# Altium schematic sheet H750Common4.SchDoc
size A3
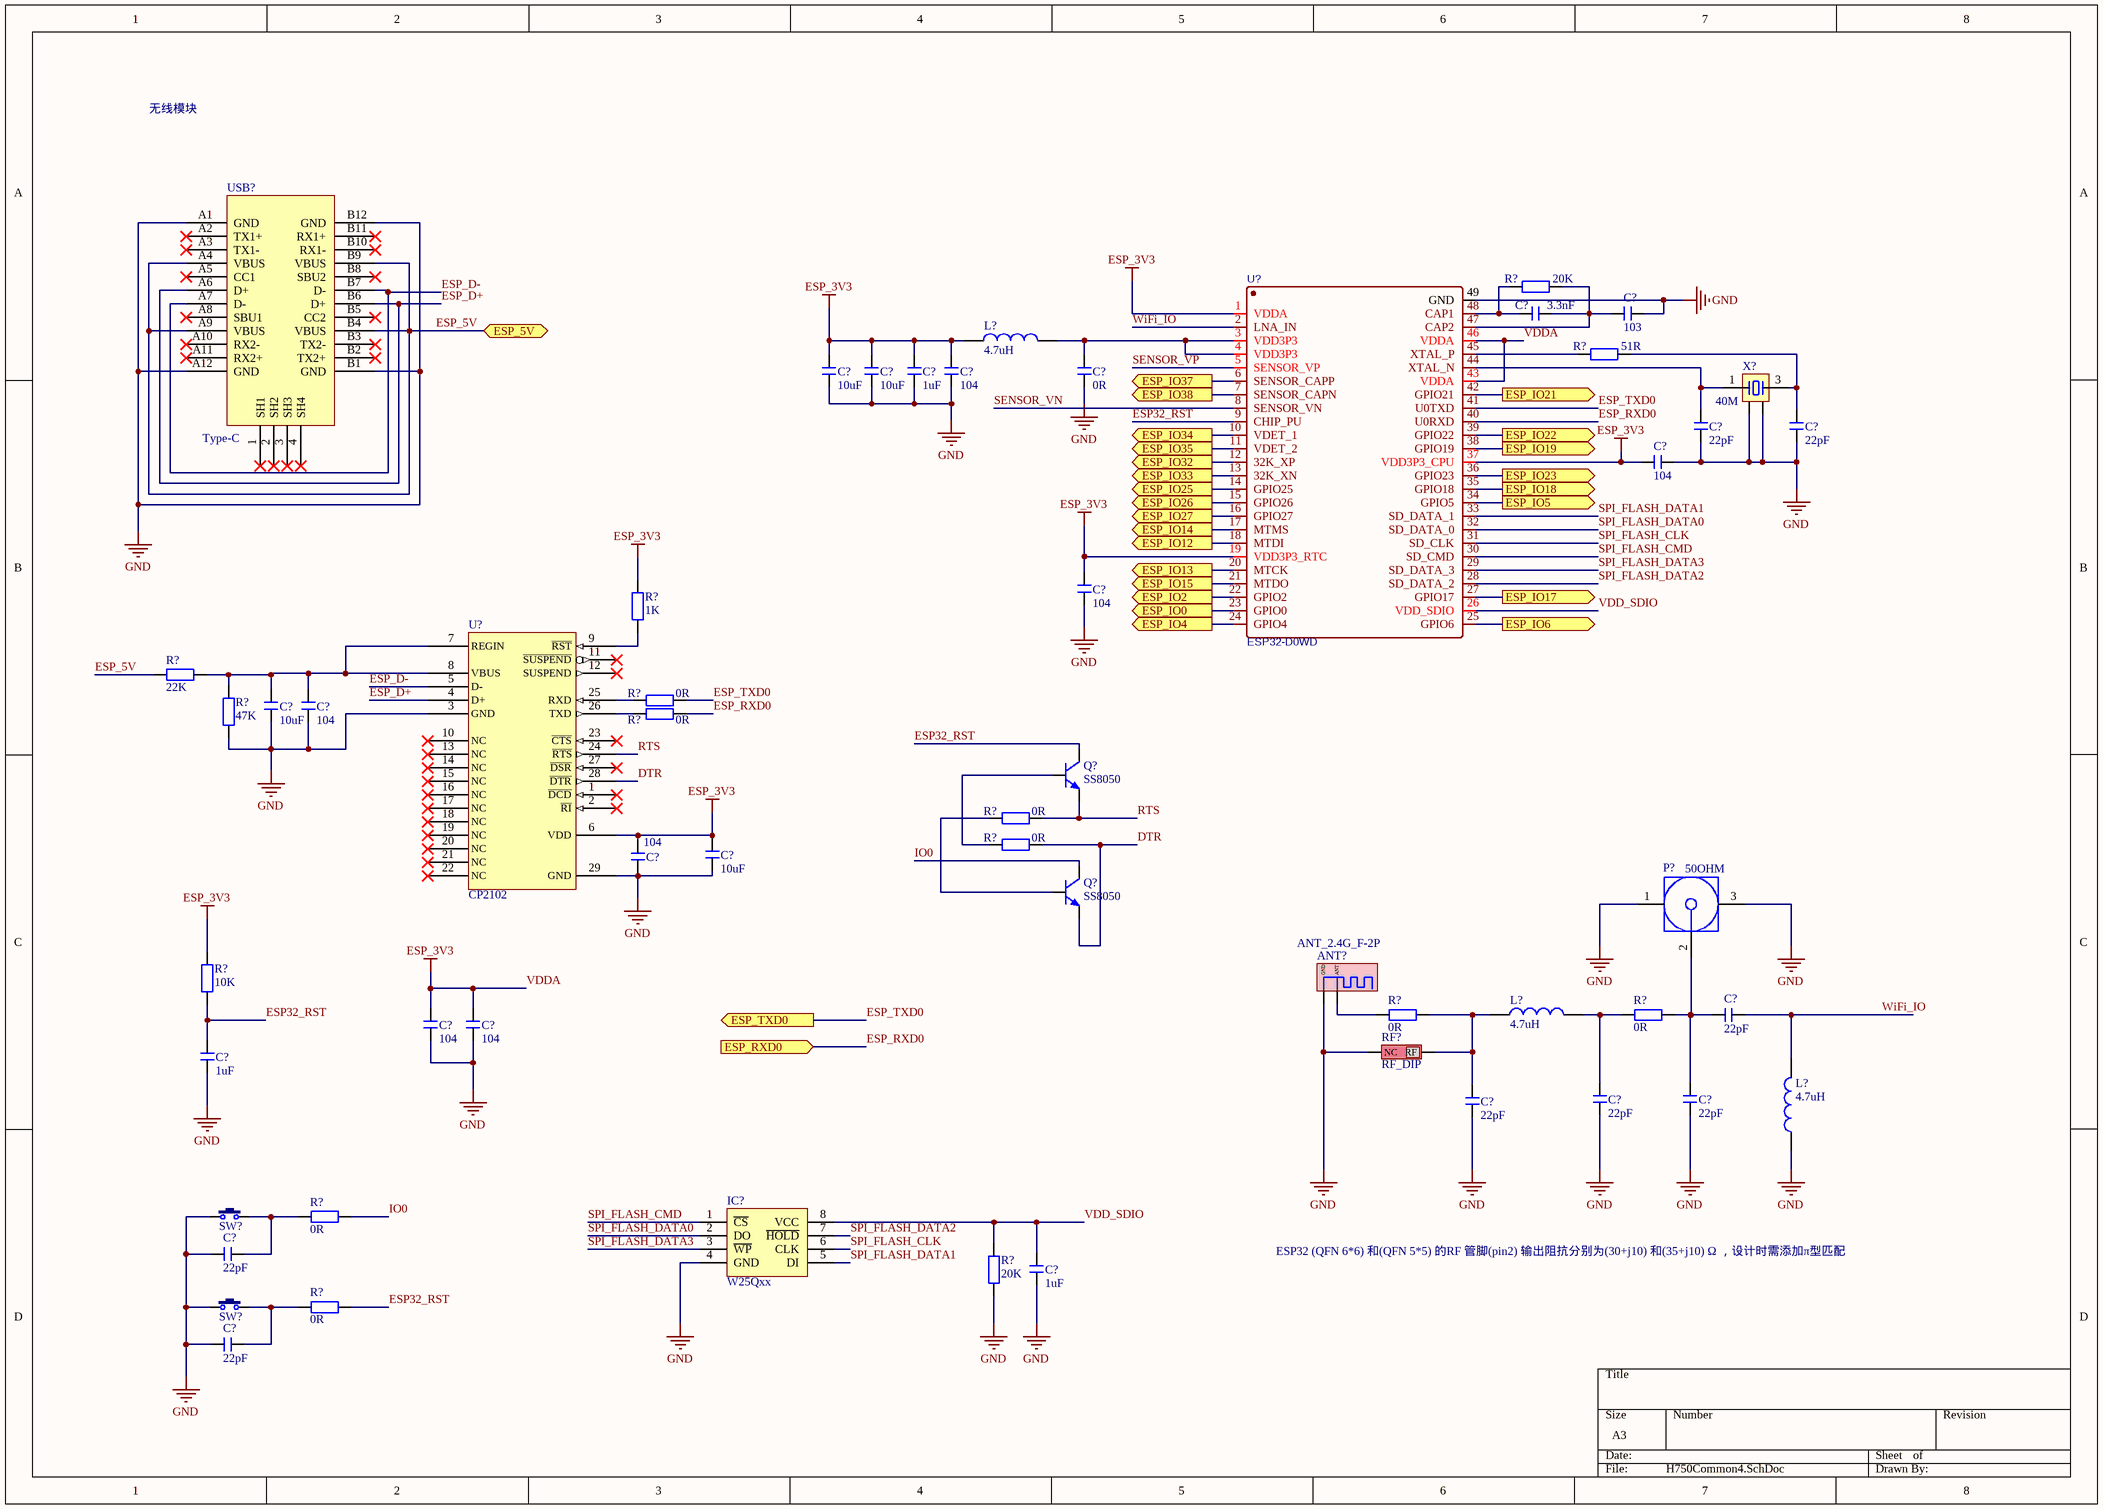
[diagram p0: H750Common4.SchDoc]

## Parts
(Parts that share a designator on the sheet are numbered #1, #2 ... from top to bottom, then left to right.)
ANT?  ANT_2.4G_F-2P  [ANT_2.4G_F-2P-1]
C?#1  3.3nF  [C 0603_L]
C?#2  103  [C 0603_L]
C?#3  10uF  [C 0603_L]
C?#4  10uF  [C 0603_L]
C?#5  1uF  [C 0603_L]
C?#6  104  [C 0603_L]
C?#7  0R  [C 0603_L]
C?#8  22pF  [C 0603_L]
C?#9  22pF  [C 0603_L]
C?#10  104  [C 0603_L]
C?#11  104  [C 0603_L]
C?#12  10uF  [C 0603_L]
C?#13  104  [C 0603_L]
C?#14  10uF  [C 0603_L]
C?#15  104  [C 0603_L]
C?#16  104  [C 0603_L]
C?#17  104  [C 0603_L]
C?#18  22pF  [C 0603_L]
C?#19  1uF  [C 0603_L]
C?#20  22pF  [C 0603_L]
C?#21  22pF  [C 0603_L]
C?#22  22pF  [C 0603_L]
C?#23  22pF  [C 0603_L]
C?#24  1uF  [C 0603_L]
C?#25  22pF  [C 0603_L]
IC?  W25Qxx  [SOP8W_N]
L?#1  4.7uH  [L 0603]
L?#2  4.7uH  [L 0603]
L?#3  4.7uH  [L 0603]
P?  50OHM  [IPEX]
Q?#1  SS8050  [SOT23-3N]
Q?#2  SS8050  [SOT23-3N]
R?#1  20K  [R 0603_L]
R?#2  51R  [R 0603_L]
R?#3  1K  [R 0603_L]
R?#4  22K  [R 0603_L]
R?#5  47K  [R 0603_L]
R?#6  0R  [R 0603_L]
R?#7  0R  [R 0603_L]
R?#8  0R  [R 0603_L]
R?#9  0R  [R 0603_L]
R?#10  10K  [R 0603_L]
R?#11  0R  [R 0603_L]
R?#12  0R  [R 0603_L]
R?#13  0R  [R 0603_L]
R?#14  20K  [R 0603_L]
R?#15  0R  [R 0603_L]
RF?  RF_DIP  [ANT_LA31H2450-A35]
SW?#1  3x6x5  [TSW SMD-3*6*2.5]  (value not drawn)
SW?#2  3x6x5  [TSW SMD-3*6*2.5]  (value not drawn)
U?#1  ESP32-D0WD  [ESP32-D0WD]
U?#2  CP2102  [CP2102-N]
USB?  Type-C  [Type-C]
X?  40M  [OSC 5032-4P]

## Ports
ESP_5V (bidir), ESP_IO0 (out), ESP_IO2 (out), ESP_IO4 (out), ESP_IO5 (out), ESP_IO6 (out), ESP_IO12 (out), ESP_IO13 (out), ESP_IO14 (out), ESP_IO15 (out), ESP_IO17 (out), ESP_IO18 (out), ESP_IO19 (out), ESP_IO21 (out), ESP_IO22 (out), ESP_IO23 (out), ESP_IO25 (out), ESP_IO26 (out), ESP_IO27 (out), ESP_IO32 (out), ESP_IO33 (out), ESP_IO34 (out), ESP_IO35 (out), ESP_IO37 (out), ESP_IO38 (out), ESP_RXD0 (in), ESP_TXD0 (out)

## Nets
GND: ANT?.2(GND) C?#2.1 C?#3.1 C?#4.1 C?#5.1 C?#6.1 C?#7.1 C?#8.1 C?#9.1 C?#10.1 C?#11.1 C?#12.1 C?#13.1 C?#14.1 C?#15.1 C?#16.2 C?#17.2 C?#19.1 C?#20.2 C?#21.2 C?#22.2 C?#23.2 C?#24.1 C?#25.2 IC?.4(GND) L?#3.1 P?.1 P?.3 R?#5.2 R?#14.2 RF?.2(NC) SW?#1.1 SW?#2.1 U?#1.49(GND) U?#2.3(GND) U?#2.29(GND) USB?.A1(GND) USB?.A12(GND) USB?.B1(GND) USB?.B12(GND) X?.2 X?.4
VDDA: C?#3.2 C?#4.2 C?#5.2 C?#6.2 C?#10.2 C?#11.2 C?#14.2 C?#15.2 C?#16.1 C?#17.1 L?#1.1 R?#3.1 R?#10.1 U?#1.1(VDDA) U?#1.19(VDD3P3_RTC) U?#1.37(VDD3P3_CPU) U?#1.43(VDDA) U?#1.46(VDDA) U?#2.6(VDD)  [also labelled ESP_3V3]
DTR: Q?#2.2(E) R?#9.2 U?#2.28(~{DTR})
ESP32_RST: C?#19.2 Q?#1.3(C) R?#10.2 R?#15.1 U?#1.9(CHIP_PU)
ESP_5V: R?#4.1 USB?.A4(VBUS) USB?.A9(VBUS) USB?.B4(VBUS) USB?.B9(VBUS) ; port ESP_5V
ESP_D+: U?#2.4(D+) USB?.A6(D+) USB?.B6(D+)
ESP_D-: U?#2.5(D-) USB?.A7(D-) USB?.B7(D-)
ESP_IO0: U?#1.23(GPIO0) ; port ESP_IO0
ESP_IO2: U?#1.22(GPIO2) ; port ESP_IO2
ESP_IO4: U?#1.24(GPIO4) ; port ESP_IO4
ESP_IO5: U?#1.34(GPIO5) ; port ESP_IO5
ESP_IO6: U?#1.25(GPIO6) ; port ESP_IO6
ESP_IO12: U?#1.18(MTDI) ; port ESP_IO12
ESP_IO13: U?#1.20(MTCK) ; port ESP_IO13
ESP_IO14: U?#1.17(MTMS) ; port ESP_IO14
ESP_IO15: U?#1.21(MTDO) ; port ESP_IO15
ESP_IO17: U?#1.27(GPIO17) ; port ESP_IO17
ESP_IO18: U?#1.35(GPIO18) ; port ESP_IO18
ESP_IO19: U?#1.38(GPIO19) ; port ESP_IO19
ESP_IO21: U?#1.42(GPIO21) ; port ESP_IO21
ESP_IO22: U?#1.39(GPIO22) ; port ESP_IO22
ESP_IO23: U?#1.36(GPIO23) ; port ESP_IO23
ESP_IO25: U?#1.14(GPIO25) ; port ESP_IO25
ESP_IO26: U?#1.15(GPIO26) ; port ESP_IO26
ESP_IO27: U?#1.16(GPIO27) ; port ESP_IO27
ESP_IO32: U?#1.12(32K_XP) ; port ESP_IO32
ESP_IO33: U?#1.13(32K_XN) ; port ESP_IO33
ESP_IO34: U?#1.10(VDET_1) ; port ESP_IO34
ESP_IO35: U?#1.11(VDET_2) ; port ESP_IO35
ESP_IO37: U?#1.6(SENSOR_CAPP) ; port ESP_IO37
ESP_IO38: U?#1.7(SENSOR_CAPN) ; port ESP_IO38
ESP_RXD0: R?#7.2 U?#1.40(U0RXD) ; port ESP_RXD0
ESP_TXD0: R?#6.2 U?#1.41(U0TXD) ; port ESP_TXD0
IO0: Q?#2.3(C) R?#13.1
RTS: Q?#1.2(E) R?#8.2 U?#2.24(~{RTS})
SENSOR_VN: U?#1.8(SENSOR_VN)
SENSOR_VP: U?#1.5(SENSOR_VP)
SPI_FLASH_CLK: IC?.6(CLK) U?#1.31(SD_CLK)
SPI_FLASH_CMD: IC?.1(~{CS}) U?#1.30(SD_CMD)
SPI_FLASH_DATA0: IC?.2(DO) U?#1.32(SD_DATA_0)
SPI_FLASH_DATA1: IC?.5(DI) U?#1.33(SD_DATA_1)
SPI_FLASH_DATA2: IC?.7(~{HOLD}) U?#1.28(SD_DATA_2)
SPI_FLASH_DATA3: IC?.3(~{WP}) U?#1.29(SD_DATA_3)
VDD_SDIO: C?#24.2 IC?.8(VCC) R?#14.1 U?#1.26(VDD_SDIO)
WiFi_IO: C?#18.1 L?#3.2 U?#1.2(LNA_IN)
NetANT?_1: ANT?.1(ANT) R?#11.2
NetC?#1_1: C?#1.1 C?#2.2 R?#1.1 U?#1.47(CAP2)
NetC?#1_2: C?#1.2 R?#1.2 U?#1.48(CAP1)
NetC?#7_2: C?#7.2 L?#1.2 U?#1.3(VDD3P3) U?#1.4(VDD3P3)
NetC?#8_2: C?#8.2 U?#1.44(XTAL_N) X?.1
NetC?#9_2: C?#9.2 R?#2.1 X?.3
NetC?#12_2: C?#12.2 C?#13.2 R?#4.2 R?#5.1 U?#2.7(REGIN) U?#2.8(VBUS)
NetC?#18_2: C?#18.2 C?#22.1 P?.2 R?#12.1
NetC?#20_1: C?#20.1 L?#2.1 R?#11.1 RF?.1(RF)
NetC?#21_1: C?#21.1 L?#2.2 R?#12.2
NetC?#23_1: C?#23.1 R?#13.2 SW?#1.2
NetC?#25_1: C?#25.1 R?#15.2 SW?#2.2
NetQ?#1_1: Q?#1.1(B) R?#9.1
NetQ?#2_1: Q?#2.1(B) R?#8.1
NetR?#2_2: R?#2.2 U?#1.45(XTAL_P)
NetR?#3_2: R?#3.2 U?#2.9(~{RST})
NetR?#6_1: R?#6.1 U?#2.25(RXD)
NetR?#7_1: R?#7.1 U?#2.26(TXD)

Not connected (* = marked no-connect by the designer): U?#2 1(~{DCD})* 2(~{RI})* 10(NC)* 11(~{SUSPEND})* 12(SUSPEND)* 13(NC)* 14(NC)* 15(NC)* 16(NC)* 17(NC)* 18(NC)* 19(NC)* 20(NC)* 21(NC)* 22(NC)* 23(~{CTS})* 27(~{DSR})*; USB? 1(SH1)* 2(SH2)* 3(SH3)* 4(SH4)* A2(TX1+)* A3(TX1-)* A5(CC1)* A8(SBU1)* A10(RX2-)* A11(RX2+)* B2(TX2+)* B3(TX2-)* B5(CC2)* B8(SBU2)* B10(RX1-)* B11(RX1+)*

## Notes on the sheet
- 无线模块
- ESP32 (QFN 6*6) 和(QFN 5*5) 的RF 管脚(pin2) 输出阻抗分别为(30+j10) 和(35+j10) Ω ，设计时需添加π型匹配

## Library data of the parts
ANT? = ANT_2.4G_F-2P: PCB天线(F-2P),2.4G; 频率: 2.4G
C?#1-C?#25 = C: 无极性贴片电容; 版权归属: 源创客; BOM名称: 无极性贴片电容; 学习资源: www.ooocke.com
IC? = W25Qxx: 外置Flash; 版权归属: 源创客; BOM名称: 外置Flash; 学习资源: www.ooocke.com
L?#1-L?#3 = L: 小功率贴片电感; 版权归属: 源创客; BOM名称: 小功率贴片电感; 学习资源: www.ooocke.com
P? = IPEX: RF Coaxial PCB Connector, MCX; Thru-Hole, Right-Angle Mount Socket, Blunt Post Terminal, 50 Ohm Impedance; PCB_Layout: Complies with manufacturer's recommendation.; DrillSize: Corresponds to nominal value.; Published: 15-Jul-2004; LatestRevisionDate: 15-Jul-2004; LatestRevisionNote: Component Replaced.; DatasheetDocument: 30-May-2003; PackageDocument: 04-Jul-1999; PackageReference: 919-119J-51AX; Publisher: Altium Limited; ComponentLink1Description: Manufacturer Link; ComponentLink1URL: http://www.amphenolrf.com/
Q?#1 Q?#2 = 8050-SMD: 高频放大-NPN型; 版权归属: 源创客; 属性: 40V 1.5A 1W 100MHZ; BOM名称: 高频放大-NPN型; 学习资源: www.ooocke.com
R?#1-R?#15 = R: 贴片电阻; 版权归属: 源创客; BOM名称: 贴片电阻; 学习资源: www.ooocke.com
RF? = ANT_3216_LA31H2450-A35: 陶瓷天线,2.4G
SW?#1 SW?#2 = TSW 3x6: 3x6轻触开关; 版权归属: 源创客; BOM名称: 3x6轻触开关; 学习资源: www.ooocke.com
U?#1 = ESP32-D0WD: BOM_Manufacturer: ESPRESSIF 乐鑫; Contributor: LCSC; BOM_Supplier: LCSC; BOM_Supplier Part: C130167; BOM_Manufacturer Part: ESP32-D0WD; BOM_JLCPCB Part Class: Extended Part; spicePre: U; spiceSymbolName: ESP32-D0WD
U?#2 = CP2102: USB 转 串口-MAX: 1Mbps
X? = XTAL-4P: 4脚无源晶振; 版权归属: 源创客; BOM名称: 4脚无源晶振; 学习资源: www.ooocke.com